# Altium schematic sheet WP7B.SchDoc: Module Connection
size C; CheckedBy: Panagiotis Gkountoumis; DocumentNumber: 1; SheetNumber: 1; SheetTotal: 4
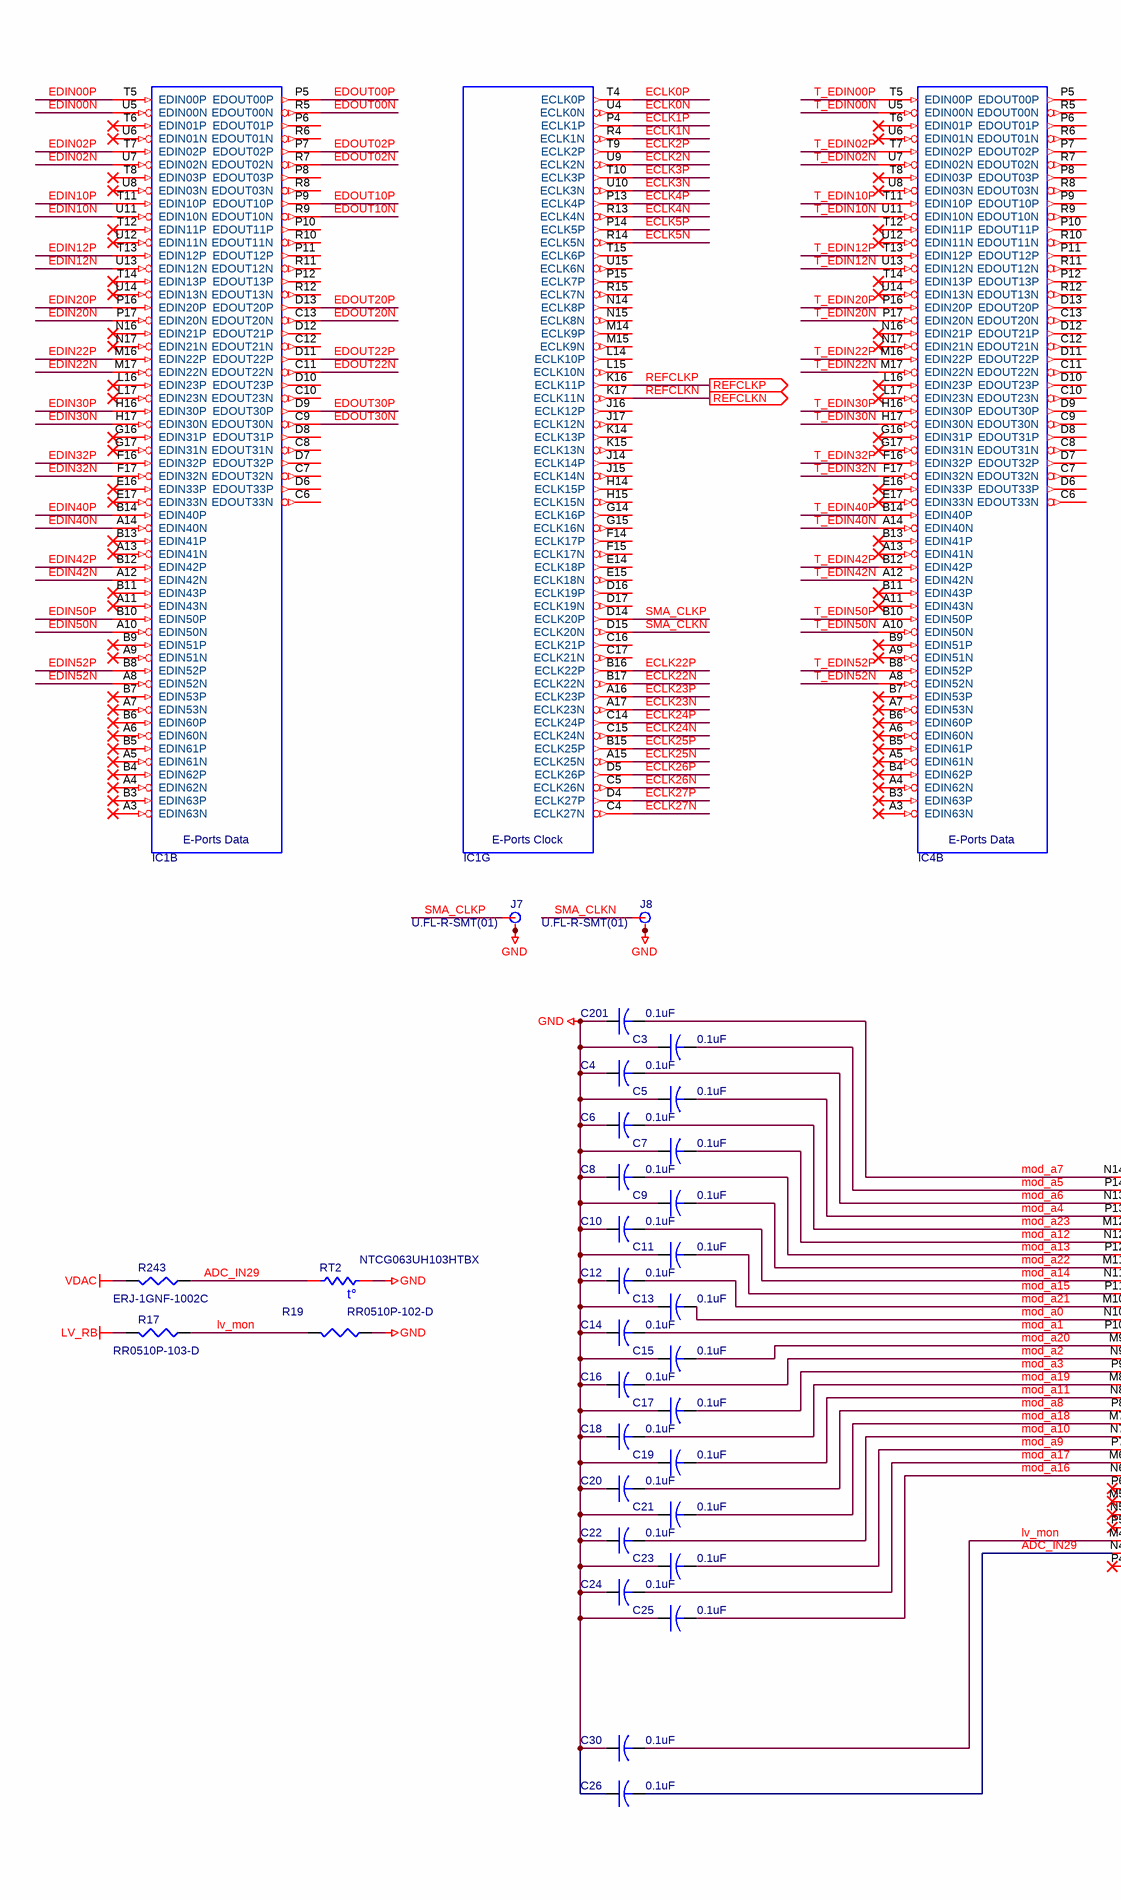
[diagram p0: WP7B.SchDoc, left]
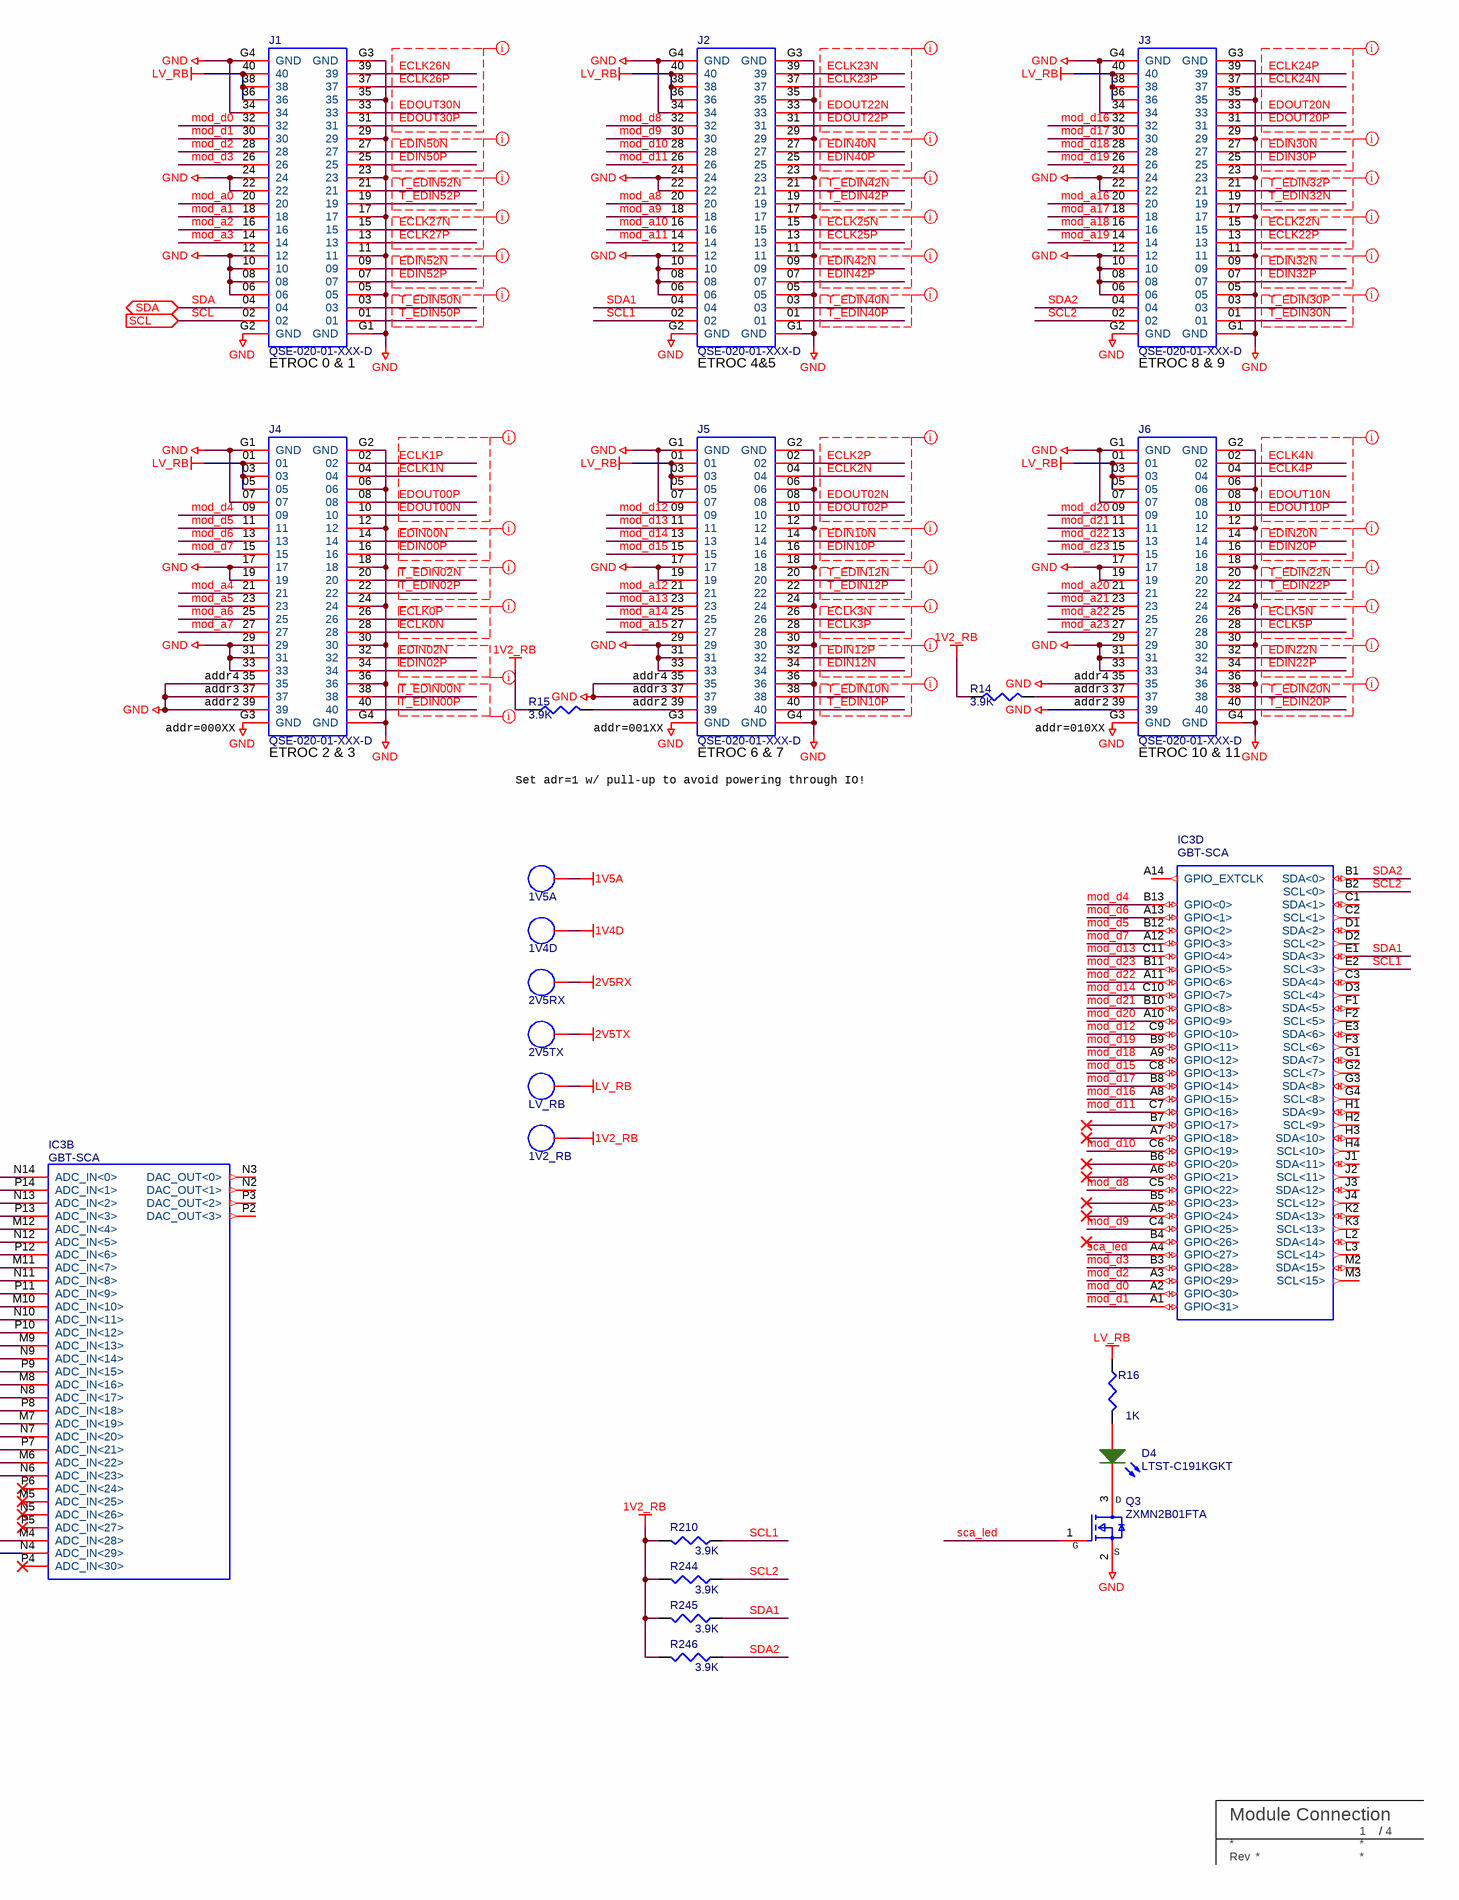
[diagram p1: WP7B.SchDoc, right]

## Parts
C3  value 0.1uF  [capc1005n]  (hidden comment: GRM155R71E104ME14D)
C4  value 0.1uF  [capc1005n]  (hidden comment: GRM155R71E104ME14D)
C5  value 0.1uF  [capc1005n]  (hidden comment: GRM155R71E104ME14D)
C6  value 0.1uF  [capc1005n]  (hidden comment: GRM155R71E104ME14D)
C7  value 0.1uF  [capc1005n]  (hidden comment: GRM155R71E104ME14D)
C8  value 0.1uF  [capc1005n]  (hidden comment: GRM155R71E104ME14D)
C9  value 0.1uF  [capc1005n]  (hidden comment: GRM155R71E104ME14D)
C10  value 0.1uF  [capc1005n]  (hidden comment: GRM155R71E104ME14D)
C11  value 0.1uF  [capc1005n]  (hidden comment: GRM155R71E104ME14D)
C12  value 0.1uF  [capc1005n]  (hidden comment: GRM155R71E104ME14D)
C13  value 0.1uF  [capc1005n]  (hidden comment: GRM155R71E104ME14D)
C14  value 0.1uF  [capc1005n]  (hidden comment: GRM155R71E104ME14D)
C15  value 0.1uF  [capc1005n]  (hidden comment: GRM155R71E104ME14D)
C16  value 0.1uF  [capc1005n]  (hidden comment: GRM155R71E104ME14D)
C17  value 0.1uF  [capc1005n]  (hidden comment: GRM155R71E104ME14D)
C18  value 0.1uF  [capc1005n]  (hidden comment: GRM155R71E104ME14D)
C19  value 0.1uF  [capc1005n]  (hidden comment: GRM155R71E104ME14D)
C20  value 0.1uF  [capc1005n]  (hidden comment: GRM155R71E104ME14D)
C21  value 0.1uF  [capc1005n]  (hidden comment: GRM155R71E104ME14D)
C22  value 0.1uF  [capc1005n]  (hidden comment: GRM155R71E104ME14D)
C23  value 0.1uF  [capc1005n]  (hidden comment: GRM155R71E104ME14D)
C24  value 0.1uF  [capc1005n]  (hidden comment: GRM155R71E104ME14D)
C25  value 0.1uF  [capc1005n]  (hidden comment: GRM155R71E104ME14D)
C26  value 0.1uF  [capc1005n]  (hidden comment: GRM155R71E104ME14D)
C30  value 0.1uF  [capc1005n]  (hidden comment: GRM155R71E104ME14D)
C201  value 0.1uF  [capc1005n]  (hidden comment: GRM155R71E104ME14D)
D4  LTST-C191KGKT  [LED_RED]
IC1  LPGBT  [BGA289X17]  (value not drawn)  (parts B,G of 8)
IC3  GBT-SCA  [BGA196C80P14X14_1200X1200X170]  (parts B,D of 6)
IC4  LPGBT  [BGA289X17]  (value not drawn)  (part B of 8)
J1  QSE-020-01-XXX-D  [SAMTEC_QSE-020-01-XXX-D]
J2  QSE-020-01-XXX-D  [SAMTEC_QSE-020-01-XXX-D]
J3  QSE-020-01-XXX-D  [SAMTEC_QSE-020-01-XXX-D]
J4  QSE-020-01-XXX-D  [SAMTEC_QSE-020-01-XXX-D]
J5  QSE-020-01-XXX-D  [SAMTEC_QSE-020-01-XXX-D]
J6  QSE-020-01-XXX-D  [SAMTEC_QSE-020-01-XXX-D]
J7  U.FL-R-SMT(01)  [U.FL-R-SMT(01)]
J8  U.FL-R-SMT(01)  [U.FL-R-SMT(01)]
Q3  ZXMN2B01FTA  [SOT-23]
R14  Parameter 1: 3.9K  [resc1005n]  (hidden comment: ERJ-2GEJ392X)
R15  Parameter 1: 3.9K  [resc1005n]  (hidden comment: ERJ-2GEJ392X)
R16  Parameter 1: 1K  [resc1005n]  (hidden comment: ERJ-2GEJ102X)
R17  RR0510P-103-D  [resc1005n]
R19  RR0510P-102-D  [resc1005n]
R210  Parameter 1: 3.9K  [resc1005n]  (hidden comment: ERJ-2GEJ392X)
R243  ERJ-1GNF-1002C  [resc0603]
R244  Parameter 1: 3.9K  [resc1005n]  (hidden comment: ERJ-2GEJ392X)
R245  Parameter 1: 3.9K  [resc1005n]  (hidden comment: ERJ-2GEJ392X)
R246  Parameter 1: 3.9K  [resc1005n]  (hidden comment: ERJ-2GEJ392X)
RT2  NTCG063UH103HTBX  [resc0603]
TBLOCK?  BU Title block  (value not drawn)  (graphical)
TP5  LV_RB  [testpoint]  (no BOM)
TP6  1V2_RB  [testpoint]  (no BOM)
TP7  1V5A  [testpoint]  (no BOM)
TP8  1V4D  [testpoint]  (no BOM)
TP9  2V5RX  [testpoint]  (no BOM)
TP10  2V5TX  [testpoint]  (no BOM)

## Ports
REFCLKN (out), REFCLKP (out), SCL (in), SDA (bidir)

## Nets
1V2_RB: R14.1 R15.1 R210.2 R244.2 R245.2 R246.2 TP6.1(TP)
1V4D: TP8.1(TP)
1V5A: TP7.1(TP)
2V5RX: TP9.1(TP)
2V5TX: TP10.1(TP)
GND: C3.1 C4.1 C5.1 C6.1 C7.1 C8.1 C9.1 C10.1 C11.1 C12.1 C13.1 C14.1 C15.1 C16.1 C17.1 C18.1 C19.1 C20.1 C21.1 C22.1 C23.1 C24.1 C25.1 C26.1 C30.1 C201.1 J1.05 J1.06 J1.08 J1.10 J1.11 J1.12 J1.17 J1.22 J1.23 J1.24 J1.29 J1.34 J1.35 J1.G1(GND) J1.G2(GND) J1.G3(GND) J1.G4(GND) J2.05 J2.06 J2.08 J2.10 J2.11 J2.12 J2.17 J2.22 J2.23 J2.24 J2.29 J2.34 J2.35 J2.G1(GND) J2.G2(GND) J2.G3(GND) J2.G4(GND) J3.05 J3.06 J3.08 J3.10 J3.11 J3.12 J3.17 J3.22 J3.23 J3.24 J3.29 J3.34 J3.35 J3.G1(GND) J3.G2(GND) J3.G3(GND) J3.G4(GND) J4.06 J4.07 J4.12 J4.17 J4.18 J4.19 J4.24 J4.29 J4.30 J4.31 J4.33 J4.35 J4.36 J4.37 J4.39 J4.G1(GND) J4.G2(GND) J4.G3(GND) J4.G4(GND) J5.06 J5.07 J5.12 J5.17 J5.18 J5.19 J5.24 J5.29 J5.30 J5.31 J5.33 J5.35 J5.36 J5.37 J5.G1(GND) J5.G2(GND) J5.G3(GND) J5.G4(GND) J6.06 J6.07 J6.12 J6.17 J6.18 J6.19 J6.24 J6.29 J6.30 J6.31 J6.33 J6.35 J6.36 J6.39 J6.G1(GND) J6.G2(GND) J6.G3(GND) J6.G4(GND) J7.2 J7.3 J7.4 J8.2 J8.3 J8.4 Q3.2(Source) R19.1 RT2.1
LV_RB: J1.36 J1.38 J1.40 J2.36 J2.38 J2.40 J3.36 J3.38 J3.40 J4.01 J4.03 J4.05 J5.01 J5.03 J5.05 J6.01 J6.03 J6.05 R16.1 R17.2 TP5.1(TP)
VDAC: R243.2
ADC_IN29: C26.2 IC3.N4(ADC_IN<29>) R243.1 RT2.2
ECLK0N: IC1.U4(ECLK0N) J4.28
ECLK0P: IC1.T4(ECLK0P) J4.26
ECLK1N: IC1.R4(ECLK1N) J4.04
ECLK1P: IC1.P4(ECLK1P) J4.02
ECLK2N: IC1.U9(ECLK2N) J5.04
ECLK2P: IC1.T9(ECLK2P) J5.02
ECLK3N: IC1.U10(ECLK3N) J5.26
ECLK3P: IC1.T10(ECLK3P) J5.28
ECLK4N: IC1.R13(ECLK4N) J6.02
ECLK4P: IC1.P13(ECLK4P) J6.04
ECLK5N: IC1.R14(ECLK5N) J6.26
ECLK5P: IC1.P14(ECLK5P) J6.28
ECLK22N: IC1.B17(ECLK22N) J3.15
ECLK22P: IC1.B16(ECLK22P) J3.13
ECLK23N: IC1.A17(ECLK23N) J2.39
ECLK23P: IC1.A16(ECLK23P) J2.37
ECLK24N: IC1.C15(ECLK24N) J3.37
ECLK24P: IC1.C14(ECLK24P) J3.39
ECLK25N: IC1.A15(ECLK25N) J2.15
ECLK25P: IC1.B15(ECLK25P) J2.13
ECLK26N: IC1.C5(ECLK26N) J1.39
ECLK26P: IC1.D5(ECLK26P) J1.37
ECLK27N: IC1.C4(ECLK27N) J1.15
ECLK27P: IC1.D4(ECLK27P) J1.13
EDIN00N: IC1.U5(EDIN00N) J4.14
EDIN00P: IC1.T5(EDIN00P) J4.16
EDIN02N: IC1.U7(EDIN02N) J4.32
EDIN02P: IC1.T7(EDIN02P) J4.34
EDIN10N: IC1.U11(EDIN10N) J5.14
EDIN10P: IC1.T11(EDIN10P) J5.16
EDIN12N: IC1.U13(EDIN12N) J5.34
EDIN12P: IC1.T13(EDIN12P) J5.32
EDIN20N: IC1.P17(EDIN20N) J6.14
EDIN20P: IC1.P16(EDIN20P) J6.16
EDIN22N: IC1.M17(EDIN22N) J6.32
EDIN22P: IC1.M16(EDIN22P) J6.34
EDIN30N: IC1.H17(EDIN30N) J3.27
EDIN30P: IC1.H16(EDIN30P) J3.25
EDIN32N: IC1.F17(EDIN32N) J3.09
EDIN32P: IC1.F16(EDIN32P) J3.07
EDIN40N: IC1.A14(EDIN40N) J2.27
EDIN40P: IC1.B14(EDIN40P) J2.25
EDIN42N: IC1.A12(EDIN42N) J2.09
EDIN42P: IC1.B12(EDIN42P) J2.07
EDIN50N: IC1.A10(EDIN50N) J1.27
EDIN50P: IC1.B10(EDIN50P) J1.25
EDIN52N: IC1.A8(EDIN52N) J1.09
EDIN52P: IC1.B8(EDIN52P) J1.07
EDOUT00N: IC1.R5(EDOUT00N) J4.10
EDOUT00P: IC1.P5(EDOUT00P) J4.08
EDOUT02N: IC1.R7(EDOUT02N) J5.08
EDOUT02P: IC1.P7(EDOUT02P) J5.10
EDOUT10N: IC1.R9(EDOUT10N) J6.08
EDOUT10P: IC1.P9(EDOUT10P) J6.10
EDOUT20N: IC1.C13(EDOUT20N) J3.33
EDOUT20P: IC1.D13(EDOUT20P) J3.31
EDOUT22N: IC1.C11(EDOUT22N) J2.33
EDOUT22P: IC1.D11(EDOUT22P) J2.31
EDOUT30N: IC1.C9(EDOUT30N) J1.33
EDOUT30P: IC1.D9(EDOUT30P) J1.31
lv_mon: C30.2 IC3.M4(ADC_IN<28>) R17.1 R19.2
mod_a0: C13.2 IC3.N10(ADC_IN<11>) J1.20
mod_a1: C14.2 IC3.P10(ADC_IN<12>) J1.18
mod_a2: C16.2 IC3.N9(ADC_IN<14>) J1.16
mod_a3: C17.2 IC3.P9(ADC_IN<15>) J1.14
mod_a4: C5.2 IC3.P13(ADC_IN<3>) J4.21
mod_a5: C3.2 IC3.P14(ADC_IN<1>) J4.23
mod_a6: C4.2 IC3.N13(ADC_IN<2>) J4.25
mod_a7: C201.2 IC3.N14(ADC_IN<0>) J4.27
mod_a8: C20.2 IC3.P8(ADC_IN<18>) J2.20
mod_a9: C23.2 IC3.P7(ADC_IN<21>) J2.18
mod_a10: C22.2 IC3.N7(ADC_IN<20>) J2.16
mod_a11: C19.2 IC3.N8(ADC_IN<17>) J2.14
mod_a12: C7.2 IC3.N12(ADC_IN<5>) J5.21
mod_a13: C8.2 IC3.P12(ADC_IN<6>) J5.23
mod_a14: C10.2 IC3.N11(ADC_IN<8>) J5.25
mod_a15: C11.2 IC3.P11(ADC_IN<9>) J5.27
mod_a16: C25.2 IC3.N6(ADC_IN<23>) J3.20
mod_a17: C24.2 IC3.M6(ADC_IN<22>) J3.18
mod_a18: C21.2 IC3.M7(ADC_IN<19>) J3.16
mod_a19: C18.2 IC3.M8(ADC_IN<16>) J3.14
mod_a20: C15.2 IC3.M9(ADC_IN<13>) J6.21
mod_a21: C12.2 IC3.M10(ADC_IN<10>) J6.23
mod_a22: C9.2 IC3.M11(ADC_IN<7>) J6.25
mod_a23: C6.2 IC3.M12(ADC_IN<4>) J6.27
mod_d0: IC3.A2(GPIO<30>) J1.32
mod_d1: IC3.A1(GPIO<31>) J1.30
mod_d2: IC3.A3(GPIO<29>) J1.28
mod_d3: IC3.B3(GPIO<28>) J1.26
mod_d4: IC3.B13(GPIO<0>) J4.09
mod_d5: IC3.B12(GPIO<2>) J4.11
mod_d6: IC3.A13(GPIO<1>) J4.13
mod_d7: IC3.A12(GPIO<3>) J4.15
mod_d8: IC3.C5(GPIO<22>) J2.32
mod_d9: IC3.C4(GPIO<25>) J2.30
mod_d10: IC3.C6(GPIO<19>) J2.28
mod_d11: IC3.C7(GPIO<16>) J2.26
mod_d12: IC3.C9(GPIO<10>) J5.09
mod_d13: IC3.C11(GPIO<4>) J5.11
mod_d14: IC3.C10(GPIO<7>) J5.13
mod_d15: IC3.C8(GPIO<13>) J5.15
mod_d16: IC3.A8(GPIO<15>) J3.32
mod_d17: IC3.B8(GPIO<14>) J3.30
mod_d18: IC3.A9(GPIO<12>) J3.28
mod_d19: IC3.B9(GPIO<11>) J3.26
mod_d20: IC3.A10(GPIO<9>) J6.09
mod_d21: IC3.B10(GPIO<8>) J6.11
mod_d22: IC3.A11(GPIO<6>) J6.13
mod_d23: IC3.B11(GPIO<5>) J6.15
REFCLKN: IC1.K17(ECLK11N) ; port REFCLKN
REFCLKP: IC1.K16(ECLK11P) ; port REFCLKP
sca_led: IC3.A4(GPIO<27>) Q3.1(Gate)
SCL: J1.02 ; port SCL
SCL1: IC3.E2(SCL<3>) J2.02 R210.1
SCL2: IC3.B2(SCL<0>) J3.02 R244.1
SDA: J1.04 ; port SDA
SDA1: IC3.E1(SDA<3>) J2.04 R245.1
SDA2: IC3.B1(SDA<0>) J3.04 R246.1
SMA_CLKN: IC1.D15(ECLK20N) J8.1
SMA_CLKP: IC1.D14(ECLK20P) J7.1
T_EDIN00N: IC4.U5(EDIN00N) J4.38
T_EDIN00P: IC4.T5(EDIN00P) J4.40
T_EDIN02N: IC4.U7(EDIN02N) J4.20
T_EDIN02P: IC4.T7(EDIN02P) J4.22
T_EDIN10N: IC4.U11(EDIN10N) J5.38
T_EDIN10P: IC4.T11(EDIN10P) J5.40
T_EDIN12N: IC4.U13(EDIN12N) J5.20
T_EDIN12P: IC4.T13(EDIN12P) J5.22
T_EDIN20N: IC4.P17(EDIN20N) J6.38
T_EDIN20P: IC4.P16(EDIN20P) J6.40
T_EDIN22N: IC4.M17(EDIN22N) J6.20
T_EDIN22P: IC4.M16(EDIN22P) J6.22
T_EDIN30N: IC4.H17(EDIN30N) J3.01
T_EDIN30P: IC4.H16(EDIN30P) J3.03
T_EDIN32N: IC4.F17(EDIN32N) J3.19
T_EDIN32P: IC4.F16(EDIN32P) J3.21
T_EDIN40N: IC4.A14(EDIN40N) J2.03
T_EDIN40P: IC4.B14(EDIN40P) J2.01
T_EDIN42N: IC4.A12(EDIN42N) J2.21
T_EDIN42P: IC4.B12(EDIN42P) J2.19
T_EDIN50N: IC4.A10(EDIN50N) J1.03
T_EDIN50P: IC4.B10(EDIN50P) J1.01
T_EDIN52N: IC4.A8(EDIN52N) J1.21
T_EDIN52P: IC4.B8(EDIN52P) J1.19
NetD4_1: D4.1(A) R16.2
NetD4_2: D4.2(K) Q3.3(Drain)
NetJ5_39: J5.39 R15.2
NetJ6_37: J6.37 R14.2

Not connected (* = marked no-connect by the designer): IC1 A3(EDIN63N)* A4(EDIN62N)* A5(EDIN61N)* A6(EDIN60N)* A7(EDIN53N)* A9(EDIN51N)* A11(EDIN43N)* A13(EDIN41N)* B3(EDIN63P)* B4(EDIN62P)* B5(EDIN61P)* B6(EDIN60P)* B7(EDIN53P)* B9(EDIN51P)* B11(EDIN43P)* B13(EDIN41P)* C6(EDOUT33N) C7(EDOUT32N) C8(EDOUT31N) C10(EDOUT23N) C12(EDOUT21N) C16(ECLK21P) C17(ECLK21N) D6(EDOUT33P) D7(EDOUT32P) D8(EDOUT31P) D10(EDOUT23P) D12(EDOUT21P) D16(ECLK19P) D17(ECLK19N) E14(ECLK18P) E15(ECLK18N) E16(EDIN33P)* E17(EDIN33N)* F14(ECLK17P) F15(ECLK17N) G14(ECLK16P) G15(ECLK16N) G16(EDIN31P)* G17(EDIN31N)* H14(ECLK15P) H15(ECLK15N) J14(ECLK14P) J15(ECLK14N) J16(ECLK12P) J17(ECLK12N) K14(ECLK13P) K15(ECLK13N) L14(ECLK10P) L15(ECLK10N) L16(EDIN23P)* L17(EDIN23N)* M14(ECLK9P) M15(ECLK9N) N14(ECLK8P) N15(ECLK8N) N16(EDIN21P)* N17(EDIN21N)* P6(EDOUT01P) P8(EDOUT03P) P10(EDOUT11P) P11(EDOUT12P) P12(EDOUT13P) P15(ECLK7P) R6(EDOUT01N) R8(EDOUT03N) R10(EDOUT11N) R11(EDOUT12N) R12(EDOUT13N) R15(ECLK7N) T6(EDIN01P)* T8(EDIN03P)* T12(EDIN11P)* T14(EDIN13P)* T15(ECLK6P) U6(EDIN01N)* U8(EDIN03N)* U12(EDIN11N)* U14(EDIN13N)* U15(ECLK6N); IC3 A5(GPIO<24>)* A6(GPIO<21>)* A7(GPIO<18>)* A14(GPIO_EXTCLK) B4(GPIO<26>)* B5(GPIO<23>)* B6(GPIO<20>)* B7(GPIO<17>)* C1(SDA<1>) C2(SCL<1>) C3(SDA<4>) D1(SDA<2>) D2(SCL<2>) D3(SCL<4>) E3(SDA<6>) F1(SDA<5>) F2(SCL<5>) F3(SCL<6>) G1(SDA<7>) G2(SCL<7>) G3(SDA<8>) G4(SCL<8>) H1(SDA<9>) H2(SCL<9>) H3(SDA<10>) H4(SCL<10>) J1(SDA<11>) J2(SCL<11>) J3(SDA<12>) J4(SCL<12>) K2(SDA<13>) K3(SCL<13>) L2(SDA<14>) L3(SCL<14>) M2(SDA<15>) M3(SCL<15>) M5(ADC_IN<25>)* N2(DAC_OUT<1>) N3(DAC_OUT<0>) N5(ADC_IN<26>)* P2(DAC_OUT<3>) P3(DAC_OUT<2>) P4(ADC_IN<30>)* P5(ADC_IN<27>)* P6(ADC_IN<24>)*; IC4 A3(EDIN63N)* A4(EDIN62N)* A5(EDIN61N)* A6(EDIN60N)* A7(EDIN53N)* A9(EDIN51N)* A11(EDIN43N)* A13(EDIN41N)* B3(EDIN63P)* B4(EDIN62P)* B5(EDIN61P)* B6(EDIN60P)* B7(EDIN53P)* B9(EDIN51P)* B11(EDIN43P)* B13(EDIN41P)* C6(EDOUT33N) C7(EDOUT32N) C8(EDOUT31N) C9(EDOUT30N) C10(EDOUT23N) C11(EDOUT22N) C12(EDOUT21N) C13(EDOUT20N) D6(EDOUT33P) D7(EDOUT32P) D8(EDOUT31P) D9(EDOUT30P) D10(EDOUT23P) D11(EDOUT22P) D12(EDOUT21P) D13(EDOUT20P) E16(EDIN33P)* E17(EDIN33N)* G16(EDIN31P)* G17(EDIN31N)* L16(EDIN23P)* L17(EDIN23N)* N16(EDIN21P)* N17(EDIN21N)* P5(EDOUT00P) P6(EDOUT01P) P7(EDOUT02P) P8(EDOUT03P) P9(EDOUT10P) P10(EDOUT11P) P11(EDOUT12P) P12(EDOUT13P) R5(EDOUT00N) R6(EDOUT01N) R7(EDOUT02N) R8(EDOUT03N) R9(EDOUT10N) R10(EDOUT11N) R11(EDOUT12N) R12(EDOUT13N) T6(EDIN01P)* T8(EDIN03P)* T12(EDIN11P)* T14(EDIN13P)* U6(EDIN01N)* U8(EDIN03N)* U12(EDIN11N)* U14(EDIN13N)*

## Layout directives
net class Dout_4: ECLK0N, ECLK0P, ECLK1N, ECLK1P, EDOUT00N, EDOUT00P
net class Din_4: EDIN00N, EDIN00P, EDIN02N, EDIN02P
net class Dout_1: ECLK26N, ECLK26P, ECLK27N, ECLK27P, EDOUT30N, EDOUT30P
net class Din_1: EDIN50N, EDIN50P, EDIN52N, EDIN52P
net class Dout_2: ECLK23N, ECLK23P, ECLK25N, ECLK25P, EDOUT22N, EDOUT22P
net class Din_2: EDIN40N, EDIN40P, EDIN42N, EDIN42P
net class Dout_5: ECLK2N, ECLK2P, ECLK3N, ECLK3P, EDOUT02N, EDOUT02P
net class Din_5: EDIN10N, EDIN10P, EDIN12N, EDIN12P
net class Dout_3: ECLK22N, ECLK22P, ECLK24N, ECLK24P, EDOUT20N, EDOUT20P
net class Din_3: EDIN30N, EDIN30P, EDIN32N, EDIN32P
net class Dout_6: ECLK4N, ECLK4P, ECLK5N, ECLK5P, EDOUT10N, EDOUT10P
net class Din_6: EDIN20N, EDIN20P, EDIN22N, EDIN22P
net class Din_T_4: T_EDIN00N, T_EDIN00P, T_EDIN02N, T_EDIN02P
net class Din_T_1: T_EDIN50N, T_EDIN50P, T_EDIN52N, T_EDIN52P
net class Din_T_2: T_EDIN40N, T_EDIN40P, T_EDIN42N, T_EDIN42P
net class Din_T_3: T_EDIN30N, T_EDIN30P, T_EDIN32N, T_EDIN32P
net class Din_T_6: T_EDIN20N, T_EDIN20P, T_EDIN22N, T_EDIN22P
net class Din_T_5: T_EDIN10N, T_EDIN10P, T_EDIN12N, T_EDIN12P

## Notes on the sheet
- (near J1) ETROC 0 & 1
- (near J2) ETROC 4&5
- (near J3) ETROC 8 & 9
- (near J4) addr4
- (near J4) addr3
- (near J5) addr4
- addr3
- addr4
- (near J4) addr=000XX
- (near J4) addr2
- (near J4) ETROC 2 & 3
- (near R15) addr=001XX
- addr2
- (near J5) ETROC 6 & 7
- addr=010XX
- (near J6) ETROC 10 & 11
- Set adr=1 w/ pull-up to avoid powering through IO!
- (in symbol LPGBT, part B) E-Ports Data
- (in symbol LPGBT, part G) E-Ports Clock
- (in symbol Res Thermal) t°
- (in symbol TITLE_BLOCK_BU) /; Rev
- (in symbol ZXMN2B01FTA) D; G; S

## Library data of the parts
C3-C26 C30 C201 = C: CERAMIC CAPACITOR
D4 = LED_GREEN: Typical RED, GREEN, YELLOW, AMBER GaAs LED; Published: 8-Jun-2000; LatestRevisionDate: 17-Jul-2002; LatestRevisionNote: Re-released for DXP Platform.; PackageVersion: Feb-2002; PackageReference: 3.2X1.6X1.1; Publisher: Altium Limited; PackageDescription: SM LED; 2 Flat Leads
IC1 IC4 = LPGBT: Low Power Gigabit Transceiver; Manufacturer: CERN; Pinout Version: 180226; Bonding: No; Device: LPGBT; Manufacturer Part Number: LPGBT; SMD: Yes; Mounted: Yes; LatestRevisionDate: 26.10.2018; PackageDescription: BGA, 289-Leads, Body 9.00x9.00mmx1.28mm, Pitch 0.50mm; Part Description: Low Power Gigabit Transceiver; Case: BGA289; Part Number: LPGBT; Pin Count: 289; Socket: No; Component Kind: Standard; Component Type: Standard; Footprint: BGA289C50P17X17_900X900X128
IC3 = CERN_GBT-SCA_REV 6.2: The Slow Control Adapter ASIC for the GBT System; Device: GBT-SCA
J1-J6 = QSE-020-01-XXX-D: 40 Position Connector Receptacle, Center Strip Contacts Surface Mount Gold; MF: Samtec; MP: QSE-020-01-F-D; SnapEDA_Link: https://www.snapeda.com/parts/QSE-020-01-F-D/Samtec/view-part/1737145/?ref=snap; Value: *; Availability: Bad; Price: None; Toby_UK-Purchase-URL: https://snapeda.com/shop?store=Toby+UK&id=1737145; Package: MAPBGA-624 Samtec
J7 J8 = U.FL-R-SMT(01): CONN U.FL RCPT STR 50 OHM SMD; Manufacturer: TE Connectivity; Connector Mounting: PCBMount; Connector Body Style: StraightJack; Impedance: 50ohm; Coaxial Termination: Solder; SVHC: NoSVHC(15-Jun-2015); Frequency Max: 3GHz; Product Range: ZDCSeries; Connector Type: SMACoaxial; Datasheet Version: Rev. B1, 03/2011; Package Reference: 5-1814832-1; Package Description: SMA Connector, Pitch 5.08 mm, 1 Position, Height 9.5 mm, Tail Length 4 mm; Contact Plating: GoldPlatedContacts; Coaxial Cable Types: -; Contact Material: BerylliumCopper; Manufacturer URL: http://www.te.com/; Datasheet URL: http://www.onlinecomponents.com/productFiles/mf-AMP/eng_cd_1814832_a.pdf
Q3 = ZXMN2B01FTA: MOSFET N-CH 20V 2.1A SOT-23-3; ComponentLink2Description: Datasheet; ComponentLink2URL: https://www.diodes.com/assets/Datasheets/ZXMN2B01F.pdf
R14-R16 R210 R244-R246 = R1: FILM RESISTOR; Text Field2: 5%
R17 R19 R243 = R1: FILM RESISTOR; Text Field2: 1%
RT2 = Res Thermal: Thermistor; Published: 24-Mar-1999; LatestRevisionDate: 29-May-2009; LatestRevisionNote: IPC-7351 Footprint Added.; PackageVersion: Mar-2003; PackageReference: 6-0805; Publisher: Altium Limited; PackageDescription: Chip Resistor 0805 Case Size; Code_IPC: RESC2012
TBLOCK? = TITLE_BLOCK_BU
TP5-TP10 = TP: TEST POINT 40MIL DIA.